# Altium schematic sheet PAGE2_ATMEL.SchDoc
size A; DrawnBy: Sean Donohue; Revision: A; SheetNumber: 2; SheetTotal: 4; Title2: ATMEL
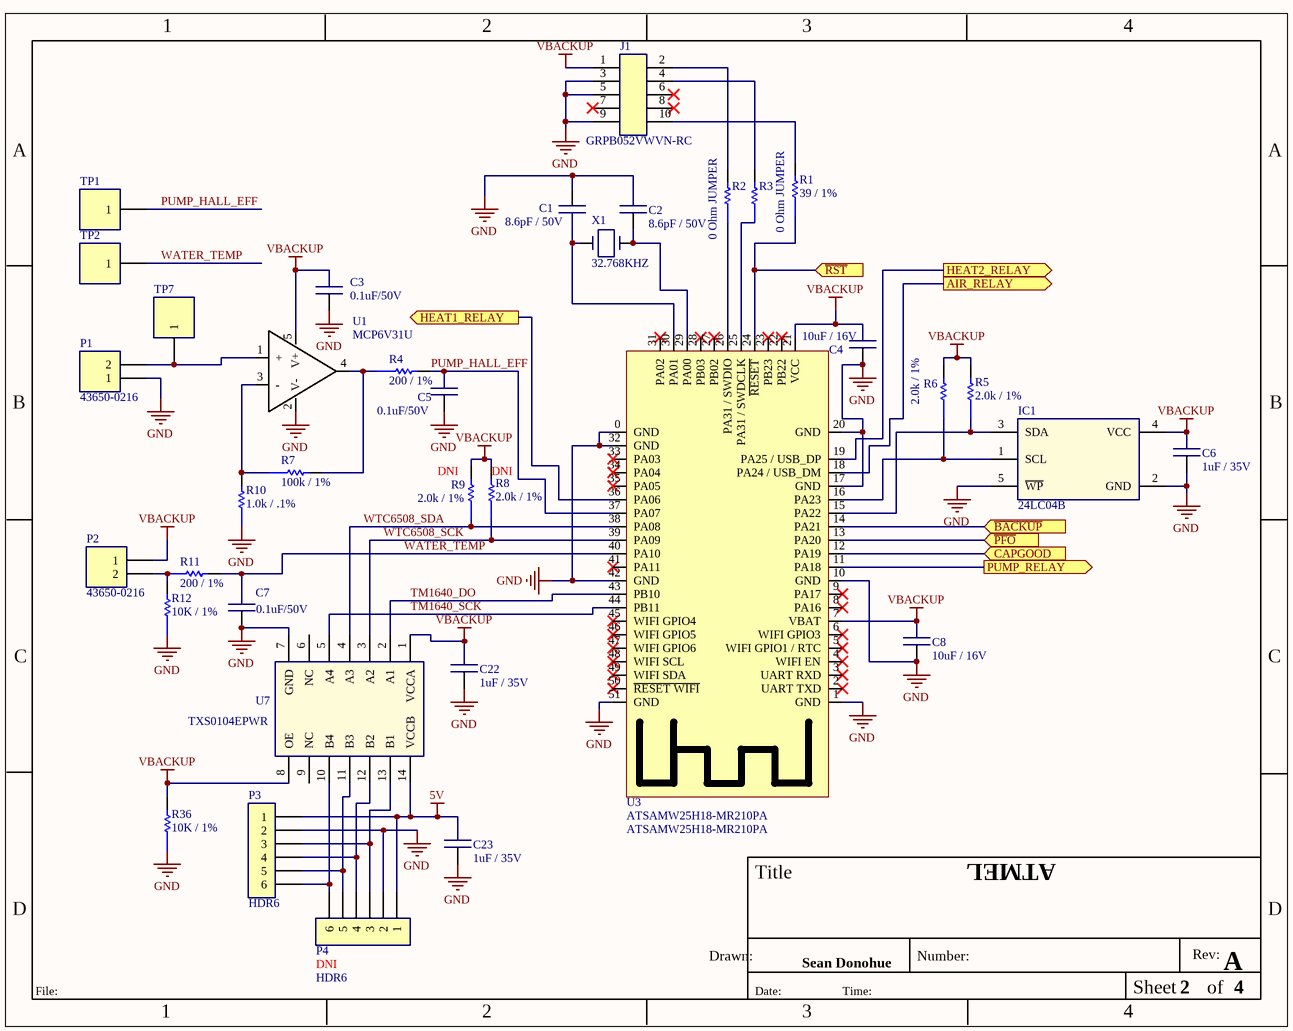
[diagram p0: PAGE2_ATMEL.SchDoc]

## Parts
C1  value 8.6pF / 50V  [0603]  (hidden comment: cap)
C2  value 8.6pF / 50V  [0603]  (hidden comment: cap)
C3  value 0.1uF/50V  [0603]  (hidden comment: cap)
C4  value 10uF / 16V  [0603]  (hidden comment: cap)
C5  value 0.1uF/50V  [0603]  (hidden comment: cap)
C6  value 1uF / 35V  [0603]  (hidden comment: cap)
C7  value 0.1uF/50V  [0603]  (hidden comment: cap)
C8  value 10uF / 16V  [0603]  (hidden comment: cap)
C22  value 1uF / 35V  [0603]  (hidden comment: cap)
C23  value 1uF / 35V  [0603]  (hidden comment: cap)
IC1  24LC04B  [SOT-23-5]
J1  value GRPB052VWVN-RC  [conn_10p_050mil]  (hidden comment: Header 10D)
P1  value 43650-0216  [conn_molex_2p_43650-0215]  (hidden comment: Header 2)
P2  value 43650-0216  [conn_molex_2p_43650-0215]  (hidden comment: Header 2)
P3  value HDR6  [HDR1X6]  (hidden comment: Header 6)
P4  value HDR6  LOAD: DNI  [HDR1X6]  (hidden comment: Header 6)
R1  value 39 / 1%  [0603]  (hidden comment: Res)
R2  value 0 Ohm JUMPER  [0603]  (hidden comment: Res)
R3  value 0 Ohm JUMPER  [0603]  (hidden comment: Res)
R4  value 200 / 1%  [0603]  (hidden comment: Res)
R5  value 2.0k / 1%  [0603]  (hidden comment: Res)
R6  value 2.0k / 1%  [0603]  (hidden comment: Res)
R7  value 100k / 1%  [0603]  (hidden comment: Res)
R8  value 2.0k / 1%  LOAD: DNI  [0603]  (hidden comment: Res)
R9  value 2.0k / 1%  LOAD: DNI  [0603]  (hidden comment: Res)
R10  value 1.0k / .1%  [0603]  (hidden comment: Res)
R11  value 200 / 1%  [0603]  (hidden comment: Res)
R12  value 10K / 1%  [0603]  (hidden comment: Res)
R36  value 10K / 1%  [0603]  (hidden comment: Res)
TP1  Header 1  [HDR1]  (value not drawn)
TP2  Header 1  [HDR1]  (value not drawn)
TP7  Header 1  [HDR1]  (value not drawn)
U1  MCP6V31U  [SOT-23-5]
U3  ATSAMW25H18-MR210PA  [ATSAMW25H18-MR210PA]
U7  TXS0104EPWR  [TSSOP-14]
X1  value 32.768KHZ  [FC-13F]  (hidden comment: crystal)

## Ports
AIR_RELAY (out), CAPGOOD (in), HEAT1_RELAY (out), HEAT2_RELAY (out), PUMP_RELAY (out), ~{BACKUP} (in), ~{PFO} (in), ~{RST} (in)

## Nets
5V: C23.1 P3.1 P4.1 U7.14(VCCB)
GND: C1.2 C2.1 C3.2 C4.2 C5.2 C6.2 C7.2 C8.2 C22.2 C23.2 IC1.2(GND) IC1.5(~{WP}) J1.3 J1.5 J1.9 P1.1 P3.2 P4.2 R10.1 R12.1 R36.1 U1.2(V-) U3.0(GND) U3.1(GND) U3.10(GND) U3.17(GND) U3.20(GND) U3.32(GND) U3.42(GND) U3.51(GND) U7.7(GND)
VBACKUP: C3.1 C4.1 C6.1 C8.1 C22.1 IC1.4(VCC) J1.1 P2.1 R5.2 R6.2 R8.2 R9.2 R36.2 U1.5(V+) U3.7(VBAT) U3.21(VCC) U7.1(VCCA) U7.8(OE)
~{BACKUP}: U3.14(PA21) ; port ~{BACKUP}
~{PFO}: U3.13(PA20) ; port ~{PFO}
~{RST}: R1.1 U3.24(~{RESET}) ; port ~{RST}
AIR_RELAY: U3.18(PA24_/_USB_DM) ; port AIR_RELAY
CAPGOOD: U3.12(PA19) ; port CAPGOOD
HEAT1_RELAY: U3.36(PA06) ; port HEAT1_RELAY
HEAT2_RELAY: U3.19(PA25_/_USB_DP) ; port HEAT2_RELAY
PUMP_HALL_EFF: C5.1 R4.2 TP1.1 U3.37(PA07)
PUMP_RELAY: U3.11(PA18) ; port PUMP_RELAY
TM1640_DO: U3.43(PB10) U7.2(A1)
TM1640_SCK: U3.44(PB11) U7.5(A4)
WATER_TEMP: C7.1 R11.2 TP2.1 U3.40(PA10)
WTC6508_SCK: R8.1 U3.39(PA09) U7.3(A2)
WTC6508_SDA: R9.1 U3.38(PA08) U7.4(A3)
NetC1_1: C1.1 U3.30(PA01) X1.1
NetC2_2: C2.2 U3.29(PA00) X1.2
NetIC1_1: IC1.1(SCL) R6.1 U3.16(PA23)
NetIC1_3: IC1.3(SDA) R5.1 U3.15(PA22)
NetJ1_2: J1.2 R2.2
NetJ1_4: J1.4 R3.2
NetJ1_10: J1.10 R1.2
NetP1_2: P1.2 TP7.1 U1.1(+)
NetP2_2: P2.2 R11.1 R12.2
NetP3_3: P3.3 P4.3 U7.13(B1)
NetP3_4: P3.4 P4.4 U7.12(B2)
NetP3_5: P3.5 P4.5 U7.11(B3)
NetP3_6: P3.6 P4.6 U7.10(B4)
NetR2_1: R2.1 U3.26(PA31_/_SWDIO)
NetR3_1: R3.1 U3.25(PA31_/_SWDCLK)
NetR4_1: R4.1 R7.2 U1.4(OUTA)
NetR7_1: R7.1 R10.2 U1.3(-)

Not connected (* = marked no-connect by the designer): J1 6* 7* 8*; U3 2(UART_TXD)* 3(UART_RXD)* 4(WIFI_EN)* 5(WIFI_GPIO1_/_RTC)* 6(WIFI_GPIO3)* 8(PA16)* 9(PA17)* 22(PB22)* 23(PB23)* 27(PB02)* 28(PB03)* 31(PA02)* 33(PA03)* 34(PA04)* 35(PA05)* 41(PA11)* 45(WIFI_GPIO4)* 46(WIFI_GPIO5)* 47(WIFI_GPIO6)* 48(WIFI_SCL)* 49(WIFI_SDA)* 50(~{RESET_WIFI})*; U7 6(NC) 9(NC)

## Notes on the sheet
- 1
- 2
- 3
- 4
- A
- B
- C
- D
- Title
- Drawn:
- Number:
- Rev:
- File:
- Date:
- Time:
- Sheet
- of

## Library data of the parts
C1 C2 = EXC143: CAP CER 8.2PF 50V NP0 0603; EetrexPN: EXC143; Mfg: KEMET; MfgPN: C0603C829J5GACTU; Vendor: Digikey; VendorPN: 399-7965-1-ND; Unit Cost: 0.25; Temp: -55°C ~ 125°C
C3 C5 C7 = ECM1045XQ: CAP CER 0.1UF 50V 10% X7R 0603; Mfg: Murata; MfgPN: GRM188R71H104KA93D; Vendor: Digikey; VendorPN: 490-1519-1-ND; Alt Mfg: TDK; Alt PN: C1608X7R1H104K; Unit Cost: 0.1; Temp: -55°C ~ 125°C; COST/10: 0.041; COST/50: 0.0222; COST/100: 0.0187; COST/500: 0.0131; EetrexPN: ECM1045XQ
C4 C8 = EXC142: CAP CER 10UF 16V X5R 0603; EetrexPN: EXC142; Mfg: Taiyo Uden; MfgPN: EMK107BBJ106MA-T; Vendor: Digkey; VendorPN: 587-3238-1-ND; Unit Cost: 0.63; Temp: -55°C ~ 85°C
C6 C22 C23 = EXC144: CAP CER 1UF 35V X7R 0603; EetrexPN: EXC144; Mfg: Murata; MfgPN: GRM188R7YA105KA12D; Vendor: Digikey; VendorPN: 490-10487-1-ND; Unit Cost: 0.27; Temp: -55°C ~ 125°C
IC1 = EXM2404ST: IC SERIAL EEPROM 4K 2.5V SOT23-5; Mfg: Microchip; MfgPN: 24LC04BT-I/OT; Vendor: Digikey; VendorPN: 24LC04BT-I/OTCT-ND; Unit Cost: 0.22; Value: 24LC04B; EetrexPN: EXM2404ST
J1 = EKP115: CONN HEADER 10POS 1.27MM GOLD T/H; EetrexPN: EKP115; Mfg: Sullins; Vendor: Digikey; VendorPN: S9015E-05-ND; Unit Cost: 0.90; MfgPN: GRPB052VWVN-RC
P1 P2 = EKP96: CONN HEADER 2POS 3MM VERT GOLD; EetrexPN: EKP96; Mfg: Molex; Vendor: Digikey; VendorPN: WM1922-ND; Alt PN: 43650-0417; Unit Cost: 0.86; Temp: -40°C ~ 105°C; UL: YES; MATE PN: 43645-0200; COST/10: 0.757; COST/50: 0.6826; COST/100: 0.653; COST/500: 0.53424; MfgPN: 43650-0216; Alt Mfg: Molex; CSA: YES
P3 P4 = ekp19: CONN HEADER 6POS .330 tall, TIN; EetrexPN: ekp19; Mfg: Samtec; MfgPN: TSW-106-07-T-S; Vendor: Digikey; VendorPN: SAM1035-06-ND; Unit Cost: 0.50
R1 = ER273: RES 39 OHM 1% 1/10W 0603 SMD; Mfg: Panasonic; MfgPN: ERJ-3EKF39R0V; Vendor: Digikey; VendorPN: P39.0HDKR-ND; EetrexPN: ER273; Unit Cost: 0.1; Temp: -55°C ~ 155°C
R2 R3 = ERE0000JP: RES 0.0 OHM 1/10W 0603 SMD; Mfg: Stackpole; MfgPN: RMCF0603ZT0R00; Vendor: Digikey; VendorPN: RMCF0603ZT0R00CT-ND; Alt Mfg: Panasonic; Alt PN: ERJ-3GEY0R00V; Unit Cost: 0.02; Temp: -55°C ~ 155°C; COST/10: 0.017; COST/50: 0.0092; COST/100: 0.007; COST/500: 0.00384; EetrexPN: ERE0000JP
R4 R11 = ER264: RES 200 OHM 1% 1/10W 0603 SMD; Mfg: Panasonic; MfgPN: ERJ-3EKF2000V; Vendor: Digikey; VendorPN: P200HCT-ND; EetrexPN: ER264; Unit Cost: 0.1; Temp: -55°C ~ 155°C
R5 R6 R8 R9 = ERE2001FP: RES 2.00K OHM 1/10W 1% 0603 SMD; Mfg: Vishay; MfgPN: CRCW06032K00FKEA; Vendor: Digikey; VendorPN: 541-2.00KHCT-ND; Alt Mfg: Panasonic; Alt PN: ERJ-3EKF2001V; Unit Cost: 0.081; Temp: -55°C ~ 155°C; COST/50: 0.0436; COST/500: 0.0251; EetrexPN: ERE2001FP; COST/10: 0.081; COST/100: 0.0436
R7 = ERE1003FP: RES 100K OHM 1/10W 1% 0603 SMD; Mfg: Panasonic; MfgPN: ERJ-3EKF1003V; Vendor: Digikey; VendorPN: P100KHCT-ND; Alt Mfg: Yageo; Alt PN: RC0603FR-07100KL; Unit Cost: 0.1; Temp: '-55°C ~ 125°C; COST/50: 0.015; COST/100: 0.0114; COST/500: 0.00624; EetrexPN: ERE1003FP; COST/10: 0.1
R10 = ERE1001BP: RES 1.0K OHM 1/10W .1% 0603 SMD; Mfg: Panasonic; MfgPN: ERA-3AEB102V; Vendor: Digikey; VendorPN: P1.0KDBCT-ND; Alt Mfg: Susumu; Alt PN: RG1608P-102-B-T5; Unit Cost: 0.124; Ref: ER150; EetrexPN: ERE1001BP
R12 R36 = ER275: RES 10K OHM 1% 1/8W 0603 SMD; Mfg: Vishay; MfgPN: MCT06030C1002FP500; Vendor: Digikey; VendorPN: MCT0603-10.0K-CFCT-ND; EetrexPN: ER275; Unit Cost: 0.17; Temp: -55°C ~ 155°C
TP1 TP2 TP7 = ekp17: CONN HEADER 1POS .330 tall, TIN; Value: HDR1; EetrexPN: ekp17; Mfg: Samtec; MfgPN: TSW-101-07-T-S; Vendor: Digikey; VendorPN: SAM1035-01-ND; Unit Cost: 0.36
U1 = E326: IC OPAMP ZRO-DRFT 300KHZ SC70-5; EetrexPN: E326; Mfg: MicroChip; MfgPN: MCP6V31UT-E/LT; Vendor: Digikey; VendorPN: MCP6V31UT-E/LTCT-ND; Unit Cost: 1.08; Temp: -40°C ~ 125°C; COST/100: 0.82; Value: MCP6V31U
U3 = E329: RF TXRX MODULE WIFI TRACE ANT; EetrexPN: E329; Mfg: Atmel; Vendor: Digikey; VendorPN: ATSAMW25H18-MR210PA-ND; Unit Cost: 26.25; Temp: -40°C ~ 85°C; COST/10: 24.235; COST/100: 20.5326; COST/500: 18.7; Value: ATSAMW25H18-MR210PA; MfgPN: ATSAMW25H18-MR210PA
U7 = E334: IC 4BIT NON-INV TRANSLTR 14TSSOP; EetrexPN: E334; Mfg: Texas Instruments; Vendor: Digikey; VendorPN: 296-20697-1-ND; Unit Cost: 1.44; Temp: -40°C ~ 85°C; Value: TXS0104EPWR; MfgPN: TXS0104EPWR
X1 = EQX7: CRYSTAL 32.768KHZ 7PF SMD; EetrexPN: EQX7; Mfg: AVX; MfgPN: ST3215SB32768C0HPWBB; Vendor: Digikey; VendorPN: 1253-1113-1-ND; Unit Cost: 0.87; TEMP: -40°C ~ 85°C; COST/10: 0.774; COST/50: 0.7232; COST/100: 0.64; COST/500: 0.6048